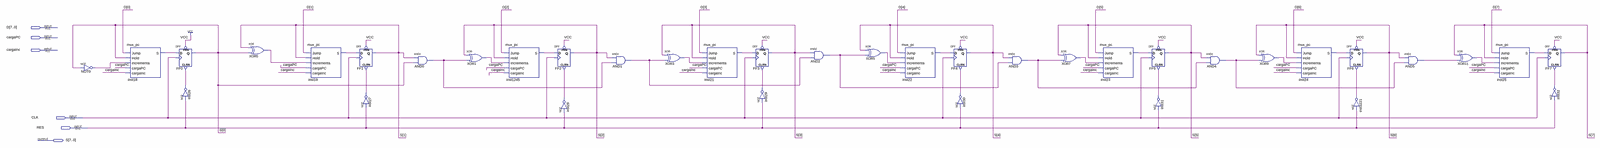
[diagram p0: schematic sheet, whole]
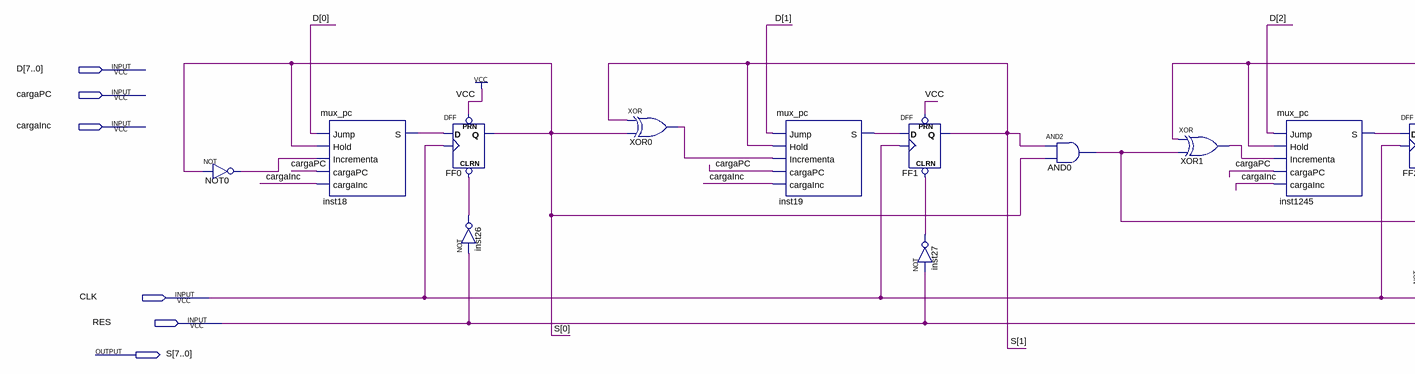
[diagram p1: schematic sheet, left part]
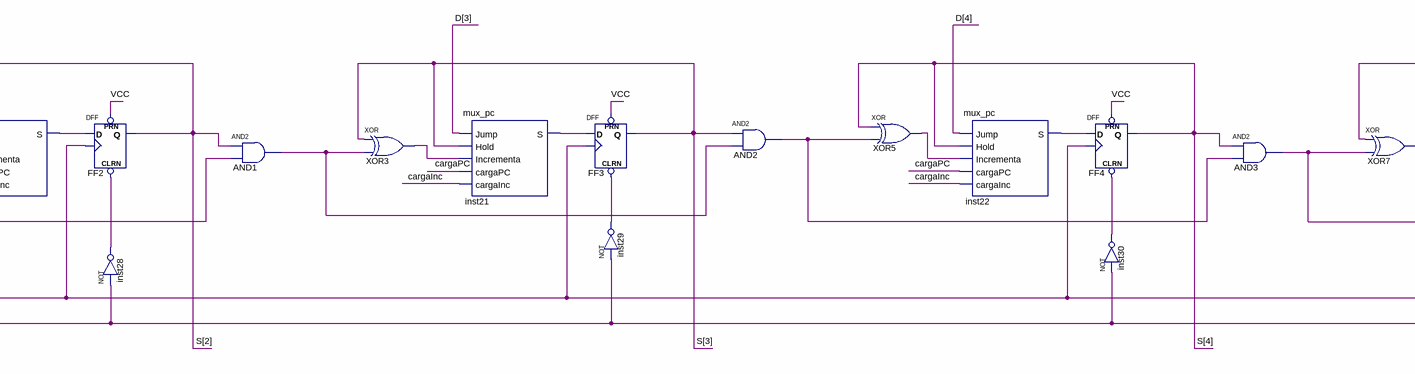
[diagram p2: schematic sheet, centre part]
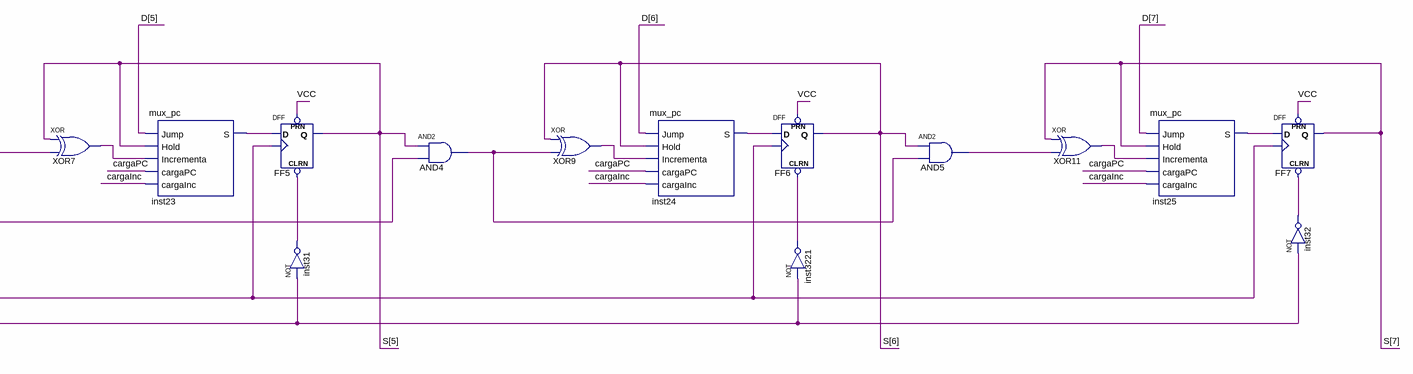
[diagram p3: schematic sheet, right part]
// Quartus schematic registrador_PC.bdf as structural Verilog: 38 symbols, 6 pins
module registrador_PC (
  input  [7:0] D,
  input  cargaPC,
  input  cargaInc,
  input  CLK,
  input  RES,
  output [7:0] S
);

  wire AND0_out, AND1_out, AND2_out, AND3_out, AND4_out, AND5_out, inst18_s, inst19_s, inst21_s, inst22_s,
       inst23_s, inst24_s, inst25_s, inst26_out, inst27_out, inst28_out, inst29_out, inst30_out, inst31_out,
       inst32_out, inst1245_s, inst3221_out, NOT0_out, XOR0_out, XOR1_out, XOR3_out, XOR5_out, XOR7_out,
       XOR9_out, XOR11_out;

  not NOT0 (NOT0_out, S[0]);
  mux_pc inst18 (.Jump(D[0]), .Hold(S[0]), .Incrementa(NOT0_out), .cargaPC(cargaPC), .cargaInc(cargaInc), .S(inst18_s));
  DFF FF0 (.CLRN(inst26_out), .CLK(CLK), .D(inst18_s), .PRN(1'b1), .Q(S[0]));
  not inst26 (inst26_out, RES);
  xor XOR0 (XOR0_out, S[1], S[0]);
  mux_pc inst19 (.Jump(D[1]), .Hold(S[1]), .Incrementa(XOR0_out), .cargaPC(cargaPC), .cargaInc(cargaInc), .S(inst19_s));
  DFF FF1 (.CLRN(inst27_out), .CLK(CLK), .D(inst19_s), .PRN(1'b1), .Q(S[1]));
  not inst27 (inst27_out, RES);
  and AND0 (AND0_out, S[1], S[0]);
  xor XOR1 (XOR1_out, S[2], AND0_out);
  mux_pc inst1245 (
    .Jump(D[2]), .Hold(S[2]), .Incrementa(XOR1_out), .cargaPC(cargaPC), .cargaInc(cargaInc), .S(inst1245_s));
  DFF FF2 (.CLRN(inst28_out), .CLK(CLK), .D(inst1245_s), .PRN(1'b1), .Q(S[2]));
  not inst28 (inst28_out, RES);
  and AND1 (AND1_out, S[2], AND0_out);
  xor XOR3 (XOR3_out, S[3], AND1_out);
  mux_pc inst21 (.Jump(D[3]), .Hold(S[3]), .Incrementa(XOR3_out), .cargaPC(cargaPC), .cargaInc(cargaInc), .S(inst21_s));
  DFF FF3 (.CLRN(inst29_out), .CLK(CLK), .D(inst21_s), .PRN(1'b1), .Q(S[3]));
  not inst29 (inst29_out, RES);
  and AND2 (AND2_out, S[3], AND1_out);
  xor XOR5 (XOR5_out, S[4], AND2_out);
  mux_pc inst22 (.Jump(D[4]), .Hold(S[4]), .Incrementa(XOR5_out), .cargaPC(cargaPC), .cargaInc(cargaInc), .S(inst22_s));
  DFF FF4 (.CLRN(inst30_out), .CLK(CLK), .D(inst22_s), .PRN(1'b1), .Q(S[4]));
  not inst30 (inst30_out, RES);
  and AND3 (AND3_out, S[4], AND2_out);
  xor XOR7 (XOR7_out, S[5], AND3_out);
  mux_pc inst23 (.Jump(D[5]), .Hold(S[5]), .Incrementa(XOR7_out), .cargaPC(cargaPC), .cargaInc(cargaInc), .S(inst23_s));
  DFF FF5 (.CLRN(inst31_out), .CLK(CLK), .D(inst23_s), .PRN(1'b1), .Q(S[5]));
  not inst31 (inst31_out, RES);
  and AND4 (AND4_out, S[5], AND3_out);
  xor XOR9 (XOR9_out, S[6], AND4_out);
  mux_pc inst24 (.Jump(D[6]), .Hold(S[6]), .Incrementa(XOR9_out), .cargaPC(cargaPC), .cargaInc(cargaInc), .S(inst24_s));
  DFF FF6 (.CLRN(inst3221_out), .CLK(CLK), .D(inst24_s), .PRN(1'b1), .Q(S[6]));
  not inst3221 (inst3221_out, RES);
  and AND5 (AND5_out, S[6], AND4_out);
  xor XOR11 (XOR11_out, S[7], AND5_out);
  mux_pc inst25 (
    .Jump(D[7]), .Hold(S[7]), .Incrementa(XOR11_out), .cargaPC(cargaPC), .cargaInc(cargaInc), .S(inst25_s));
  DFF FF7 (.CLRN(inst32_out), .CLK(CLK), .D(inst25_s), .PRN(1'b1), .Q(S[7]));
  not inst32 (inst32_out, RES);
endmodule
